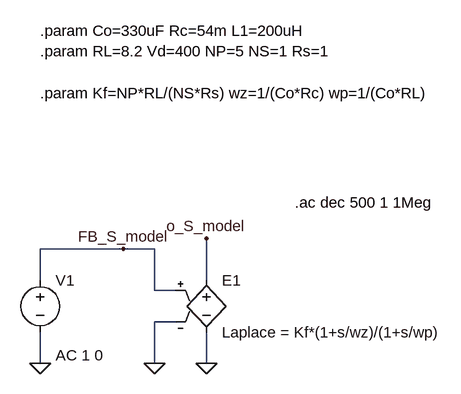
[diagram p0: schematic Go_FB.asc]
Go_FB.asc, the LTspice schematic file:
Version 4
SHEET 1 948 680
WIRE 128 144 0 144
WIRE 176 144 128 144
WIRE 0 192 0 144
WIRE 256 192 256 128
WIRE 176 208 176 144
WIRE 208 208 176 208
WIRE 208 256 176 256
WIRE 0 320 0 272
WIRE 176 320 176 256
WIRE 256 320 256 272
FLAG 256 320 0
FLAG 0 320 0
FLAG 256 128 o_S_model
FLAG 176 320 0
FLAG 128 144 FB_S_model
SYMBOL e 256 176 R0
SYMATTR InstName E1
SYMATTR Value Laplace = Kf*(1+s/wz)/(1+s/wp)
SYMBOL voltage 0 176 R0
WINDOW 123 24 132 Left 0
WINDOW 39 0 0 Left 0
SYMATTR InstName V1
SYMATTR Value ""
SYMATTR Value2 AC 1 0
TEXT 0 -192 Left 0 !.param Co=330uF Rc=54m L1=200uH\n.param RL=8.2 Vd=400 NP=5 NS=1 Rs=1
TEXT 0 -96 Left 0 !.param Kf=NP*RL/(NS*Rs) wz=1/(Co*Rc) wp=1/(Co*RL)
TEXT 392 72 Left 0 !.ac dec 500 1 1Meg

The netlist it stands for:
* Go_FB.asc
E1 o_S_model 0 FB_S_model 0 Laplace = Kf*(1+s/wz)/(1+s/wp)
V1 FB_S_model 0 AC 1 0
.param Co=330uF Rc=54m L1=200uH
.param RL=8.2 Vd=400 NP=5 NS=1 Rs=1
.param Kf=NP*RL/(NS*Rs) wz=1/(Co*Rc) wp=1/(Co*RL)
.ac dec 500 1 1Meg
.backanno
.end